# Altium schematic sheet [05] - RTC.SchDoc: RTC
size A3; Date: 15/4/2025; ApprovedBy: Vo Que Son; DrawnBy: Le Viet Trong; SheetNumber: 5; SheetTotal: 5
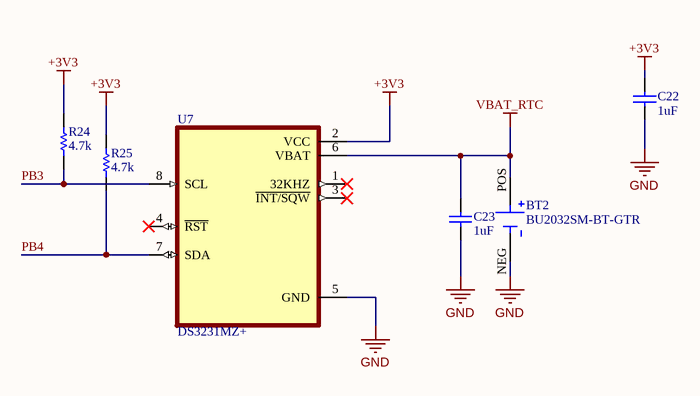
[diagram p0: [05] - RTC.SchDoc]

## Parts
BT2  BU2032SM-BT-GTR  [BAT_BU2032SM-BT-GTR]
C22  1uF  [CAP_0603]
C23  1uF  [CAP_0603]
R24  4.7k  [resistor_0603]
R25  4.7k  [resistor_0603]
U7  DS3231MZ+  [SOIC127P600X175-8N]

## Nets
+3V3: C22.2 R24.1 R25.1 U7.2(VCC)
GND: BT2.NEG C22.1 C23.1 U7.5(GND)
VBAT_RTC: BT2.POS C23.2 U7.6(VBAT)
PB3: R24.2 U7.8(SCL)
PB4: R25.2 U7.7(SDA)

Not connected (* = marked no-connect by the designer): U7 1(32KHZ)* 3(~{INT/SQW})* 4(~{RST})*

## Notes on the sheet
- Title:
- Desc:
- Designed by:
- Checked by:
- Date:
- Document No:
- Revision:
- Size:
- A3
- Approved by:
- Sheet
- of

## Library data of the parts
BT2 = BU2032SM-BT-GTR: Battery Holder (Open) Coin, 20.0mm 1 Cell SMD (SMT) Tab; MF: Memory Protection Devices; SnapEDA_Link: https://www.snapeda.com/parts/BU2032SM-BT-GTR/Memory+Protection+Devices/view-part/?ref=snap; Package: None; Value: *; MP: BU2032SM-BT-GTR; Check_prices: https://www.snapeda.com/parts/BU2032SM-BT-GTR/Memory+Protection+Devices/view-part/?ref=eda
C22 C23 = 01060310510: CAP, size 0603, 1uF; Supply 1 SN: 885012206126; Supply 1 name: Wurth Elektronik; Supply 2 name: Thegioiic; Capacitance Tolerance: +/-10%; ComponentLink1Description: Manufacturer; ComponentLink1URL: http://www.we-online.de; ComponentLink2Description: Datasheet; ComponentLink2URL: https://www.we-online.com/components/products/datasheet/885012206126.pdf; Operating Temperature: -55 to +125degC; Packaging: Tape and Reel; Supply 1 URL: https://www.we-online.com/en/components/products/WCAP-CSGP-50VDC?sq=885012206126#885012206126; Supply 2 SN: *; Supply 2 URL: https://www.thegioiic.com/tu-gom-0603-1uf-50v; Dissipation Factor: *; Height: *; Mounting Technology: SMT; Size: 0603; Capacitance: 1uF; Technical Reference: *
R24 R25 = 0006031031: RES, 4.7k Ohm, size 0603, 1%; Resistance: 10k; Resistance Tolerant: +/-1%; Rated Power: 1/4W; Supply 1 Name: Mouser; Supply 1 SN: 755-ESR03EZPF1002; Supply 2 Name: Digikey; Supply 2 SN: RHM10KADTR-ND RHM10KADCT-ND RHM10KADDKR-ND; Size: 0603; Mounting Technology: SMT; ComponentLink1Description: Datasheet link; ComponentLink1URL: https://fscdn.rohm.com/en/products/databook/datasheet/passive/resistor/chip_resistor/esr-e.pdf; ComponentLink2Description: Supply 1 URL; ComponentLink2URL: https://www.mouser.vn/ProductDetail/ROHM-Semiconductor/ESR03EZPF1002?qs=sGAEpiMZZMvdGkrng054t67Efho1F8r6CDeAsqwFse8%3D; ComponentLink3Description: Supply 2 URL; ComponentLink3URL: https://www.digikey.com/en/products/detail/rohm-semiconductor/ESR03EZPF1002/1983429
U7 = DS3231MZ+: Â±5ppm, I2C Real-Time Clock; MF: Analog Devices; SnapEDA_Link: https://www.snapeda.com/parts/DS3231MZ+/Analog+Devices/view-part/?ref=snap; Package: SOIC-8 Maxim; Value: *; MP: DS3231MZ+; Check_prices: https://www.snapeda.com/parts/DS3231MZ+/Analog+Devices/view-part/?ref=eda